# Altium schematic sheet RX.SchDoc
size A4
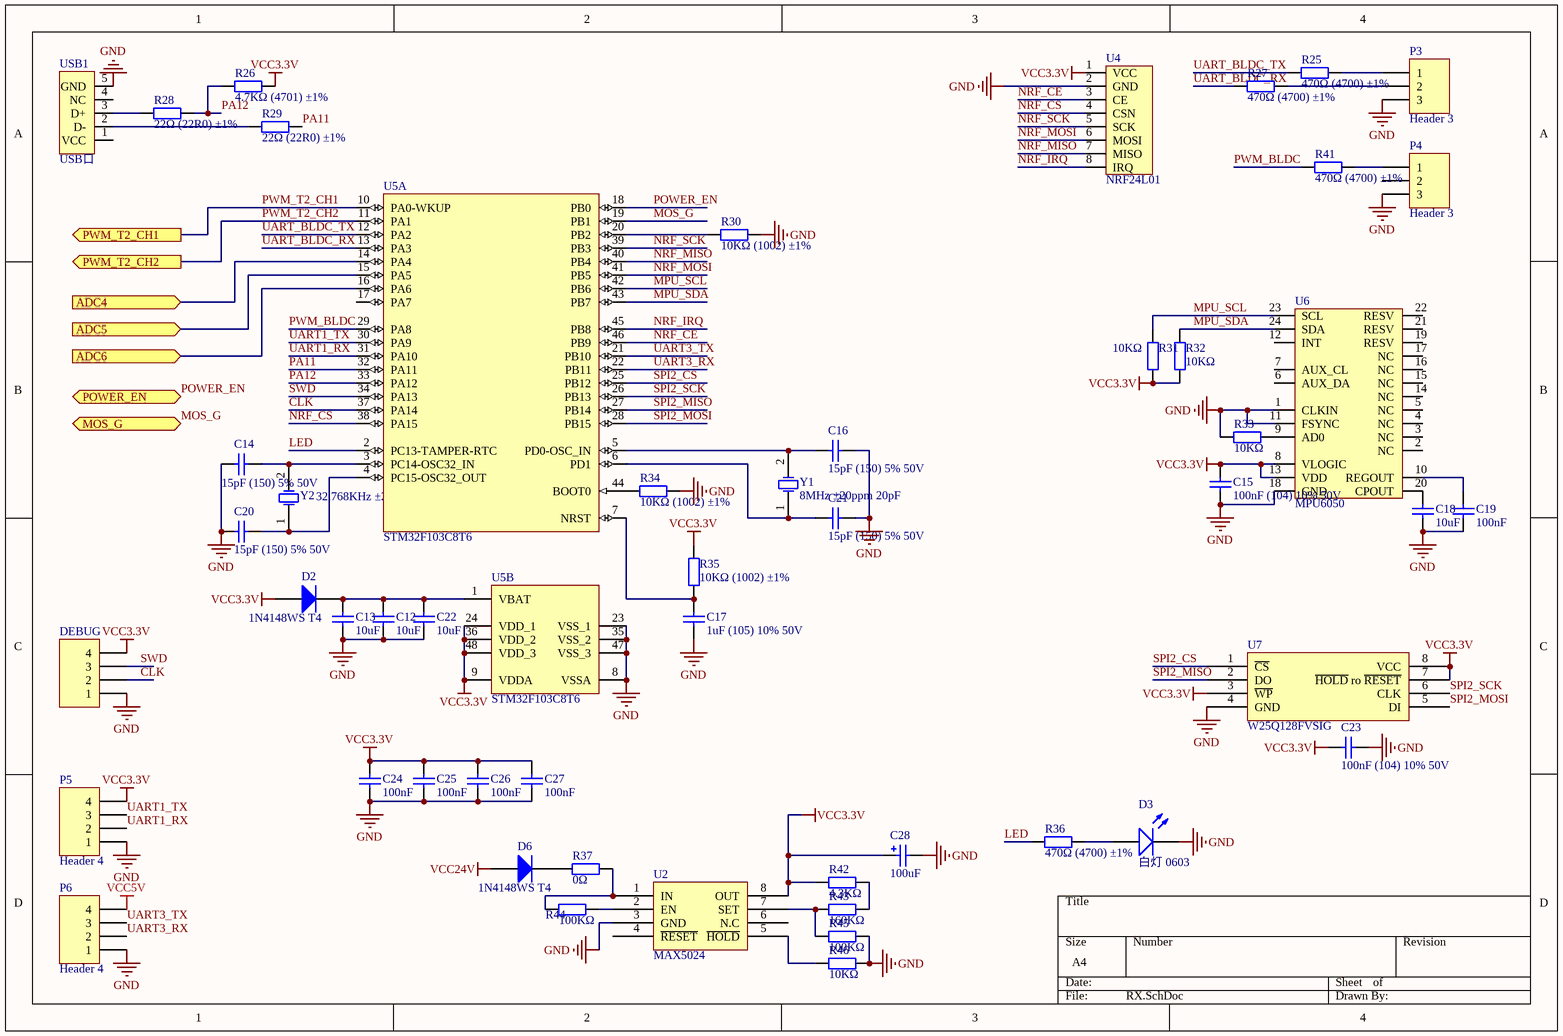
[diagram p0: RX.SchDoc]

## Parts
C12  10uF  [0603_C]
C13  10uF  [0603_C]
C14  15pF (150) 5% 50V  [0603_C]
C15  100nF (104) 10% 50V  [0603_C]
C16  15pF (150) 5% 50V  [0603_C]
C17  1uF (105) 10% 50V  [0603_C]
C18  10uF  [0603_C]
C19  100nF  [0603_C]
C20  15pF (150) 5% 50V  [0603_C]
C21  15pF (150) 5% 50V  [0603_C]
C22  10uF  [0603_C]
C23  100nF (104) 10% 50V  [0603_C]
C24  100nF  [0603_C]
C25  100nF  [0603_C]
C26  100nF  [0603_C]
C27  100nF  [0603_C]
C28  100uF  [CASE-B_3528]
D2  1N4148WS T4  [SOD-323]
D3  白灯 0603  [0603_LED_S1]
D6  1N4148WS T4  [SOD-323]
DEBUG  Header 4  [HDR1X4]  (value not drawn)
P3  Header 3  [HDR1X3]
P4  Header 3  [HDR1X3]
P5  Header 4  [HDR1X4]
P6  Header 4  [HDR1X4]
R25  470Ω (4700) ±1%  [0603_R]
R26  4.7KΩ (4701) ±1%  [0603_R]
R27  470Ω (4700) ±1%  [0603_R]
R28  22Ω (22R0) ±1%  [0603_R]
R29  22Ω (22R0) ±1%  [0603_R]
R30  10KΩ (1002) ±1%  [0603_R]
R31  10KΩ  [0603_R]
R32  10KΩ  [0603_R]
R33  10KΩ  [0603_R]
R34  10KΩ (1002) ±1%  [0603_R]
R35  10KΩ (1002) ±1%  [0603_R]
R36  470Ω (4700) ±1%  [0603_R]
R37  0Ω  [0805_R]
R41  470Ω (4700) ±1%  [0603_R]
R42  4.3KΩ  [0603_R]
R43  160KΩ  [0603_R]
R44  100KΩ  [0603_R]
R45  100KΩ  [0603_R]
R46  10KΩ  [0603_R]
U2  MAX5024  [SOIC-8_EP_150mil]
U4  NRF24L01  [miniNRF24L01]
U5  STM32F103C8T6  [LQFP-48_7x7x05P]  (parts A,B of 2)
U6  MPU6050  [QFN24]
U7  W25Q128FVSIG  [SOIC-8_208mil]
USB1  USB口  [MICRO USB]
Y1  8MHz ±20ppm 20pF  [SMD-3215_2P FC - 135]
Y2  32.768KHz ±20ppm 12.5pF  [SMD-3215_2P FC - 135]

## Ports
ADC4 (in), ADC5 (in), ADC6 (in), MOS_G (out), POWER_EN (out), PWM_T2_CH1 (out), PWM_T2_CH2 (out)

## Nets
GND: C12.1 C13.1 C14.1 C15.2 C16.2 C17.1 C18.1 C19.2 C20.1 C21.2 C22.1 C23.1 C24.2 C25.2 C26.2 C27.2 C28.2 D3.K DEBUG.1 P3.3 P4.3 P5.1 P6.1 R30.2 R33.1 R34.2 R45.2 R46.2 U2.3(GND) U4.2(GND) U5.8(VSSA) U5.23(VSS_1) U5.35(VSS_2) U5.47(VSS_3) U6.1(CLKIN) U6.11(FSYNC) U6.18(GND) U7.4(GND) USB1.5(GND)
VCC3.3V: C15.1 C23.2 C24.1 C25.1 C26.1 C27.1 C28.1 D2.1(A) DEBUG.4 P5.4 R26.2 R31.1 R32.2 R35.2 R42.1 U2.8(OUT) U4.1(VCC) U5.9(VDDA) U5.24(VDD_1) U5.36(VDD_2) U5.48(VDD_3) U6.8(VLOGIC) U6.13(VDD) U7.3(~{WP}) U7.7(~{HOLD}_ro_~{RESET}) U7.8(VCC)
VCC5V: P6.4
VCC24V: D6.1(A)
ADC4: U5.14(PA4) ; port ADC4
ADC5: U5.15(PA5) ; port ADC5
ADC6: U5.16(PA6) ; port ADC6
CLK: DEBUG.2 U5.37(PA14)
LED: R36.1 U5.2(PC13-TAMPER-RTC)
MOS_G: U5.19(PB1) ; port MOS_G
MPU_SCL: R31.2 U5.42(PB6) U6.23(SCL)
MPU_SDA: R32.1 U5.43(PB7) U6.24(SDA)
NRF_CE: U4.3(CE) U5.46(PB9)
NRF_CS: U4.4(CSN) U5.38(PA15)
NRF_IRQ: U4.8(IRQ) U5.45(PB8)
NRF_MISO: U4.7(MISO) U5.40(PB4)
NRF_MOSI: U4.6(MOSI) U5.41(PB5)
NRF_SCK: U4.5(SCK) U5.39(PB3)
PA11: R29.2 U5.32(PA11)
PA12: R26.1 R28.2 U5.33(PA12)
POWER_EN: U5.18(PB0) ; port POWER_EN
PWM_BLDC: R41.1 U5.29(PA8)
PWM_T2_CH1: U5.10(PA0-WKUP) ; port PWM_T2_CH1
PWM_T2_CH2: U5.11(PA1) ; port PWM_T2_CH2
SPI2_CS: U5.25(PB12) U7.1(~{CS})
SPI2_MISO: U5.27(PB14) U7.2(DO)
SPI2_MOSI: U5.28(PB15) U7.5(DI)
SPI2_SCK: U5.26(PB13) U7.6(CLK)
SWD: DEBUG.3 U5.34(PA13)
UART1_RX: P5.2 U5.31(PA10)
UART1_TX: P5.3 U5.30(PA9)
UART3_RX: P6.2 U5.22(PB11)
UART3_TX: P6.3 U5.21(PB10)
UART_BLDC_RX: R27.1 U5.13(PA3)
UART_BLDC_TX: R25.1 U5.12(PA2)
NetC12_2: C12.2 C13.2 C22.2 D2.2(K) U5.1(VBAT)
NetC14_2: C14.2 U5.3(PC14-OSC32_IN) Y2.2(OSC2)
NetC16_1: C16.1 U5.5(PD0-OSC_IN) Y1.2(OSC2)
NetC17_2: C17.2 R35.1 U5.7(NRST)
NetC18_2: C18.2 U6.20(CPOUT)
NetC19_1: C19.1 U6.10(REGOUT)
NetC20_2: C20.2 U5.4(PC15-OSC32_OUT) Y2.1(OSC1)
NetC21_1: C21.1 U5.6(PD1) Y1.1(OSC1)
NetD3_A: D3.A R36.2
NetD6_2: D6.2(K) R37.1
NetP3_1: P3.1 R25.2
NetP3_2: P3.2 R27.2
NetP4_1: P4.1 R41.2
NetR28_1: R28.1 USB1.3(D+)
NetR29_1: R29.1 USB1.2(D-)
NetR30_1: R30.1 U5.20(PB2)
NetR33_2: R33.2 U6.9(AD0)
NetR34_1: R34.1 U5.44(BOOT0)
NetR37_2: R37.2 R44.1 U2.1(IN)
NetR42_2: R42.2 R43.2
NetR43_1: R43.1 R45.1 U2.7(SET)
NetR44_2: R44.2 U2.2(EN)
NetR46_1: R46.1 U2.5(~{HOLD})

Not connected (* = marked no-connect by the designer): P4 2; U2 4(~{RESET}) 6(N.C); U5 17(PA7); U6 2(NC) 3(NC) 4(NC) 5(NC) 6(AUX_DA) 7(AUX_CL) 12(INT) 14(NC) 15(NC) 16(NC) 17(NC) 19(RESV) 21(RESV) 22(RESV); USB1 1(VCC) 4(NC)

## Library data of the parts
C12 C13 C18 C22 = 0603 10uF (106) 10% 10V: 贴片电容; ComponentLink1Description: 供应商链接; ComponentLink1URL: http://www.szlcsc.com/product/details_20411.html; Package: 0603; Supplier: LC; SuppliersPartNumber: C19702
C14 C16 C20 C21 = 0603 15pF (150) 5% 50V: 贴片电容; ComponentLink1Description: 供应商链接; ComponentLink1URL: http://www.szlcsc.com/product/details_1996.html; Package: 0603; Supplier: LC; SuppliersPartNumber: C1644
C15 C19 C23-C27 = 0603 100nF (104) 10% 50V: 贴片电容; ComponentLink1Description: 供应商链接; ComponentLink1URL: http://www.szlcsc.com/product/details_15331.html; Package: 0603; Supplier: LC; SuppliersPartNumber: C14663
C17 = 0603 1uF (105) 10% 50V: 贴片电容; ComponentLink1Description: 供应商链接; ComponentLink1URL: http://www.szlcsc.com/product/details_16531.html; Package: 0603; Supplier: LC; SuppliersPartNumber: C15849
C28 = 3528 100uF (107) 10% 6.3V: 钽电容; ComponentLink1Description: 供应商链接; ComponentLink1URL: http://www.szlcsc.com/product/details_16815.html; Package: 3528; Supplier: LC; SuppliersPartNumber: C16133
D2 D6 = SOD-323 1N4148WS T4: 二极管; ComponentLink1Description: 供应商链接; ComponentLink1URL: http://www.szlcsc.com/product/details_2485.html; Package: SOD-323; Supplier: LC; SuppliersPartNumber: C2128
D3 = 0603 白灯: 发光二极管; ComponentLink1Description: 供应商链接; ComponentLink1URL: http://www.szlcsc.com/product/details_2663.html; Package: 0603; Supplier: LC; SuppliersPartNumber: C2290
DEBUG P5 P6 = Header 4: Header, 4-Pin; LatestRevisionDate: 17-Jul-2002; LatestRevisionNote: Re-released for DXP Platform.; Publisher: Altium Limited
P3 P4 = Header 3: Header, 3-Pin; LatestRevisionDate: 17-Jul-2002; LatestRevisionNote: Re-released for DXP Platform.; Publisher: Altium Limited
R25 R27 R36 R41 = 0603 470Ω (4700) 1%: 贴片电阻; ComponentLink1Description: 供应商链接; ComponentLink1URL: http://www.szlcsc.com/product/details_23906.html; Package: 0603; Supplier: LC; SuppliersPartNumber: C23179
R26 = 0603 4.7KΩ (4701) 1%: 贴片电阻; ComponentLink1Description: 供应商链接; ComponentLink1URL: http://www.szlcsc.com/product/details_23889.html; Package: 0603; Supplier: LC; SuppliersPartNumber: C23162
R28 R29 = 0603 22Ω (22R0) 1%: 贴片电阻; ComponentLink1Description: 供应商链接; ComponentLink1URL: http://www.szlcsc.com/product/details_24078.html; Package: 0603; Supplier: LC; SuppliersPartNumber: C23345
R30-R35 R46 = 0603 10KΩ (1002) 1%: 贴片电阻; ComponentLink1Description: 供应商链接; ComponentLink1URL: http://www.szlcsc.com/product/details_26547.html; Package: 0603; Supplier: LC; SuppliersPartNumber: C25804
R37 = 0805 0Ω (0R0) 1%: 贴片电阻; ComponentLink1Description: 供应商链接; ComponentLink1URL: http://www.szlcsc.com/product/details_18165.html; Package: 0805; Supplier: LC; SuppliersPartNumber: C17477
R42 = 0603 4.3KΩ (4301) 1%: 贴片电阻; ComponentLink1Description: 供应商链接; ComponentLink1URL: http://www.szlcsc.com/product/details_23886.html; Package: 0603; Supplier: LC; SuppliersPartNumber: C23159
R43 = 0603 160KΩ (1603) 1%: 贴片电阻; ComponentLink1Description: 供应商链接; ComponentLink1URL: http://www.szlcsc.com/product/details_23540.html; Package: 0603; Supplier: LC; SuppliersPartNumber: C22813
R44 R45 = 0603 100KΩ (1003) 1%: 贴片电阻; ComponentLink1Description: 供应商链接; ComponentLink1URL: http://www.szlcsc.com/product/details_26546.html; Package: 0603; Supplier: LC; SuppliersPartNumber: C25803
U2 = MAX5024: LDO 65Vmax
U5 = STM32F103C8T6: ARM; ComponentLink1Description: 供应商链接; ComponentLink1URL: http://www.szlcsc.com/product/details_9243.html; Package: LQFP-48_7x7x05P; Supplier: LC; SuppliersPartNumber: C8734
U6 = MPU6050: 9轴运动处理传感器
U7 = W25Q128FVSIG: Flash ROM; ComponentLink1Description: 供应商链接; ComponentLink1URL: http://www.szlcsc.com/product/details_36072.html; Package: SOIC-8; Supplier: LC; SuppliersPartNumber: C35101
Y1 = SMD-5032_2P 8MHz 20ppm 20pF: 贴片晶振; ComponentLink1Description: 供应商链接; ComponentLink1URL: http://www.szlcsc.com/product/details_117214.html; Package: SMD-5032_2P; Supplier: LC; SuppliersPartNumber: C115962
Y2 = SMD-3215_2P 32.768KHz 20ppm 12.5pF: 贴片晶振; ComponentLink1Description: 供应商链接; ComponentLink1URL: http://www.szlcsc.com/product/details_33310.html; Package: SMD-3215_2P; Supplier: LC; SuppliersPartNumber: C32346